# Altium project Octopus.PrjPcb
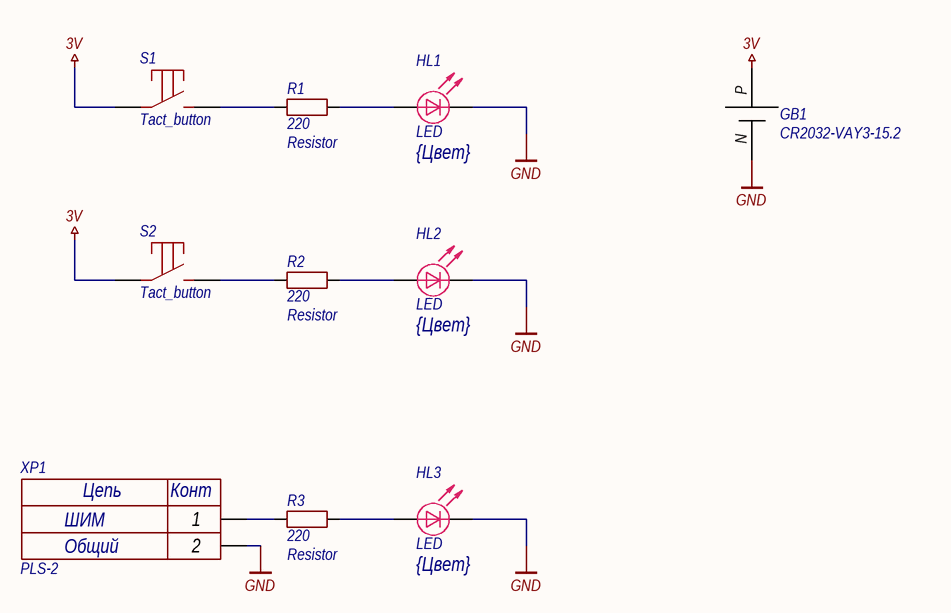
[diagram p0: Octo.SchDoc]
Version: 02; Title: Брелок осьминожка; Release_Date: 18.06.25; DrawnBy: Карманов С.; Decimal_Number_Shematic: ГИДР.123456.006; Decimal_Number_PCB: ГИДР.123456.007
1 sheet, 10 parts. Net scope: global (net labels, ports and power ports of the same name join across sheets).
Board file: opus.PcbDoc

## Sheet Octo.SchDoc: Брелок осьминожка
size 420 x 297 mm; Address1: Address1; Address2: Address2; Address3: Address3; Address4: Address4; SheetNumber: 1; SheetTotal: 1

### Parts
GB1  CR2032-VAY3-15.2  [CR2032-VAY3-15.2]
HL1  LED  Color: {Цвет}  [3mm_led_red]
HL2  LED  Color: {Цвет}  [3mm_led_red]
HL3  LED  Color: {Цвет}  [3mm_led_red]
R1  Resistor  value 220  [RES_THT_025W_220]
R2  Resistor  value 220  [RES_THT_025W_220]
R3  Resistor  value 220  [RES_THT_025W_220]
S1  Tact_button  [Button_tht_6X6]
S2  Tact_button  [Button_tht_6X6]
XP1  PLS-2  Value2: Общий  Value1: ШИМ  [PLS2]

### Nets
3V: GB1.P S1.1 S2.1
GND: GB1.N HL1.2 HL2.2 HL3.2 XP1.2
NetHL1_1: HL1.1 R1.2
NetHL2_1: HL2.1 R2.2
NetHL3_1: HL3.1 R3.2
NetR1_1: R1.1 S1.2
NetR2_1: R2.1 S2.2
NetR3_1: R3.1 XP1.1

### Notes on the sheet
- Перв. примен.
- Справ. №
- Подп. и дата
- Инв. № дубл.
- Взам. инв. №
- Разраб.
- Изм.
- Лист
- № докум.
- Подп.
- Дата
- Лит.
- Масса
- Масштаб
- Пров.
- Т.контр.
- Схема электрическая принципиальная
- Листов
- Инв. № подл.
- Утв.
- Н.контр.
- Копировал
- Формат А3
- (in symbol PLS-2) Цепь; Конт

### Library data of the parts
GB1 = CR2032-VAY3-15.2: Li, MnO2 батарея типоразмера R20, 3В, 0.22Ач, приваренные выводы, -20...60 °C; Part Number: CR2032-VAY3-15.2
HL1-HL3 = LED: Светодиод; Part Number: LED
R1-R3 = Resistor_220_1_0603: Резистор номиналом 220 Ом и точностью 1%; Power: *; Part Number: Resistor_220_1_0603; Tolerance: 1%
S1 S2 = Tact_button: Тактовая кнопка; Part Number: Tact_button
XP1 = PLS-2: Гребенка 2 пина; System: Connector; Part Number: PLS-2

## Assembly variants
01: all parts fitted